# EAGLE design esp12f-dev-breakout (EAGLE 9.3.0)
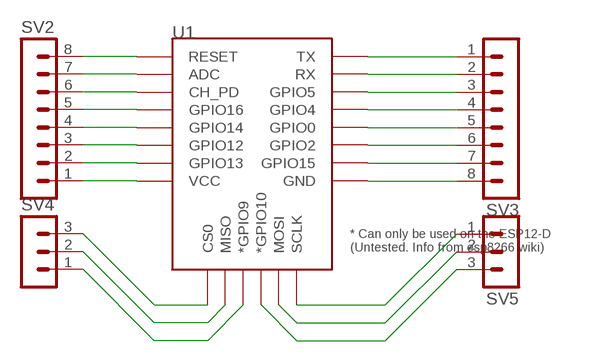
[diagram p0: schematic, sheet 1]

## Parts
SV2  MA08-1  [MA08-1]
SV3  MA08-1  [MA08-1]
SV4  MA03-1  [MA03-1]
SV5  MA03-1  [MA03-1]
U1  ESP12ESMD  [ESP12E-SMD]

## Nets
N$1: SV2.8 U1.RESET
N$2: SV2.7 U1.ADC
N$3: SV2.6 U1.CH_PD
N$4: SV2.4 U1.GPIO14
N$5: SV2.3 U1.GPIO12
N$6: SV2.2 U1.GPIO13
N$7: SV2.1 U1.VCC
N$8: SV2.5 U1.GPIO16
N$9: SV3.1 U1.TXD0(TX)
N$10: SV3.2 U1.RXD0(RX)
N$11: SV3.3 U1.GPIO5
N$12: SV3.4 U1.GPIO4
N$13: SV3.5 U1.GPIO0
N$14: SV3.6 U1.GPIO2
N$15: SV3.7 U1.GPIO15
N$16: SV3.8 U1.GND
N$17: SV4.3 U1.CS0
N$18: SV4.2 U1.MISO
N$19: SV4.1 U1.GPIO9(*GPIO9)
N$20: SV5.1 U1.SCLK
N$21: SV5.2 U1.MOSI
N$22: SV5.3 U1.GPIO10(*GPIO10)

## Library data of the parts
SV2 SV3 = con-lstb:MA08-1: PIN HEADER; OC_FARNELL: unknown; OC_NEWARK: unknown
SV4 SV5 = con-lstb:MA03-1: PIN HEADER; OC_FARNELL: unknown; OC_NEWARK: unknown
U1 = esp8266modules:ESP12E: ESP12E Module

## Board
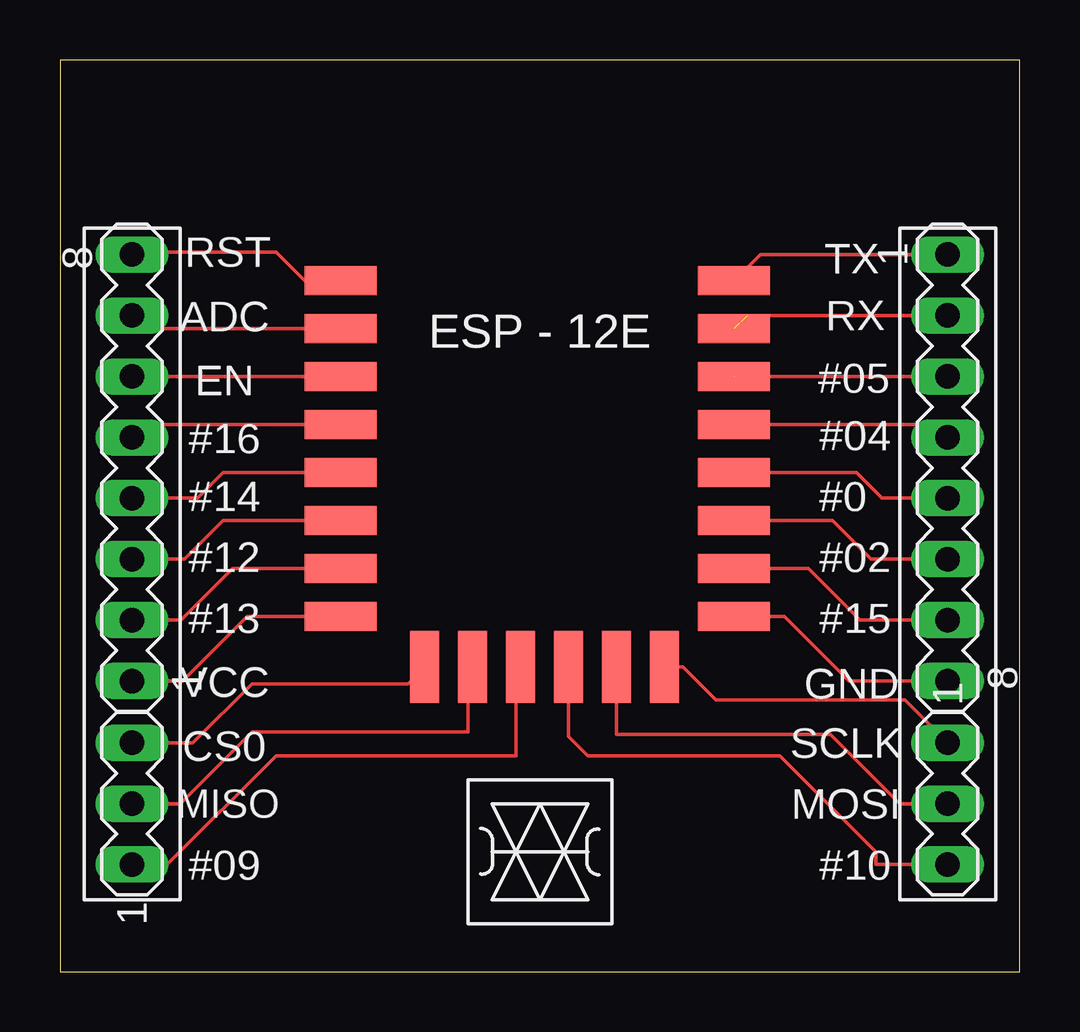
[diagram p1: board, top side]

Size 40 x 38 mm. Coordinates in mm from the lower left corner, seen from the top.
Outline: 0,0 40,0 40,38 0,38 0,0
Copper layers (1*16): Top 0.035mm / dielectric 1.5mm / Bottom 0.035mm
Design rules "default": minimum track width 6mil, minimum drill 0.35mm, track to track 6mil, track to pad 6mil, pad to pad 6mil, via to via 6mil, smd to smd 6mil, copper to edge 40mil, drill to drill 6mil, minimum pad ring 10mil, minimum via ring 8mil, stop-mask expansion 4mil, vias tented up to drill 0mil, thermal gap 10mil

### Footprints (pad centres in the part's own frame; a part is rotated, then mirrored left to right if it is on the bottom)
MA08-1 = drill 1.016 long: 1 -8.89,0; 2 -6.35,0; 3 -3.81,0; 4 -1.27,0; 5 1.27,0; 6 3.81,0; 7 6.35,0; 8 8.89,0
MA03-1 = drill 1.016 long: 1 -2.54,0; 2 0,0; 3 2.54,0
ESP12E-SMD = smd 3 x 1.2: ADC -8.3,3.8; CH_PD -8.3,1.8; GND 8.1,-8.2; GPIO0 8.1,-2.2; GPIO2 8.1,-4.2; GPIO4 8.1,-0.2; GPIO5 8.1,1.8; GPIO12 -8.3,-4.2; GPIO13 -8.3,-6.2; GPIO14 -8.3,-2.2; GPIO15 8.1,-6.2; GPIO16 -8.3,-0.2; RESET -8.3,5.8; RXD0 8.1,3.8; TXD0 8.1,5.8; VCC -8.3,-8.2 | smd 1.2 x 3: CS0 -4.8,-10.3; GPIO9 -0.8,-10.3; GPIO10 1.2,-10.3; MISO -2.8,-10.3; MOSI 3.2,-10.3; SCLK 5.2,-10.3

### Placement (x,y rotation side)
SV2  3,21 90 top
SV3  37,21 270 top
SV4  3,7 90 top
SV5  37,7 270 top
U1  20,23 0 top

### Tracks (layer width: path | path; a pad name or v marks a point on that pad's centre or on a via)
N$1
  Top 0.152: SV2.8 3.11,30 9,30 10.2,28.8 U1.RESET
N$2
  Top 0.152: SV2.7 3.55,26.8 U1.ADC
N$3
  Top 0.152: U1.CH_PD SV2.6
N$4
  Top 0.152: SV2.4 5.73,19.73 6.8,20.8 U1.GPIO14
N$5
  Top 0.152: SV2.3 5.19,17.19 6.8,18.8 U1.GPIO12
N$6
  Top 0.152: U1.GPIO13 7.2,16.8 5.05,14.65 SV2.2
N$7
  Top 0.152: SV2.1 5.11,12.11 7.8,14.8 U1.VCC
N$8
  Top 0.152: SV2.5 3.53,22.8 U1.GPIO16
N$9
  Top 0.152: SV3.1 29.19,29.89 U1.TXD0
N$10  (1 unrouted)
  Top 0.152: 28.65,27.35 SV3.2
N$11  (1 unrouted)
  Top 0.152: U1.GPIO5 SV3.3
N$12
  Top 0.152: SV3.4 36.47,22.8 U1.GPIO4
N$13
  Top 0.152: SV3.5 34.27,19.73 33.2,20.8 U1.GPIO0
N$14
  Top 0.152: SV3.6 33.81,17.19 32.2,18.8 U1.GPIO2
N$15
  Top 0.152: SV3.7 33.35,14.65 31.2,16.8 U1.GPIO15
N$16
  Top 0.152: U1.GND 30.2,14.8 32.89,12.11 SV3.8
N$17
  Top 0.152: SV4.3 5.54,9.54 8,12 14.5,12 U1.CS0
N$18
  Top 0.152: SV4.2 5,7 8,10 17,10 17,11 17,12.5 U1.MISO
N$19
  Top 0.152: SV4.1 4.46,4.46 9,9 19,9 19,11 19,12.5 U1.GPIO9
N$20
  Top 0.152: SV5.1 35.22,11.32 27.34,11.32 25.96,12.7 U1.SCLK
N$21
  Top 0.152: SV5.2 35,7 32.11,9.89 23.2,9.89 U1.MOSI
N$22
  Top 0.152: U1.GPIO10 21.2,9.8 22,9 30,9 34,5 34,4.46 SV5.3

### Text on the board
bNames: ESP-12F Breakout Board
tSilk: RST | TX | ADC | RX | EN | #05 | #16 | #04 | #14 | #0 | #12 | #02 | #13 | #15 | VCC | GND | SCLK | CS0 | MISO | MOSI | #09 | #10